# EAGLE design vc4pn (EAGLE 6.6.0)
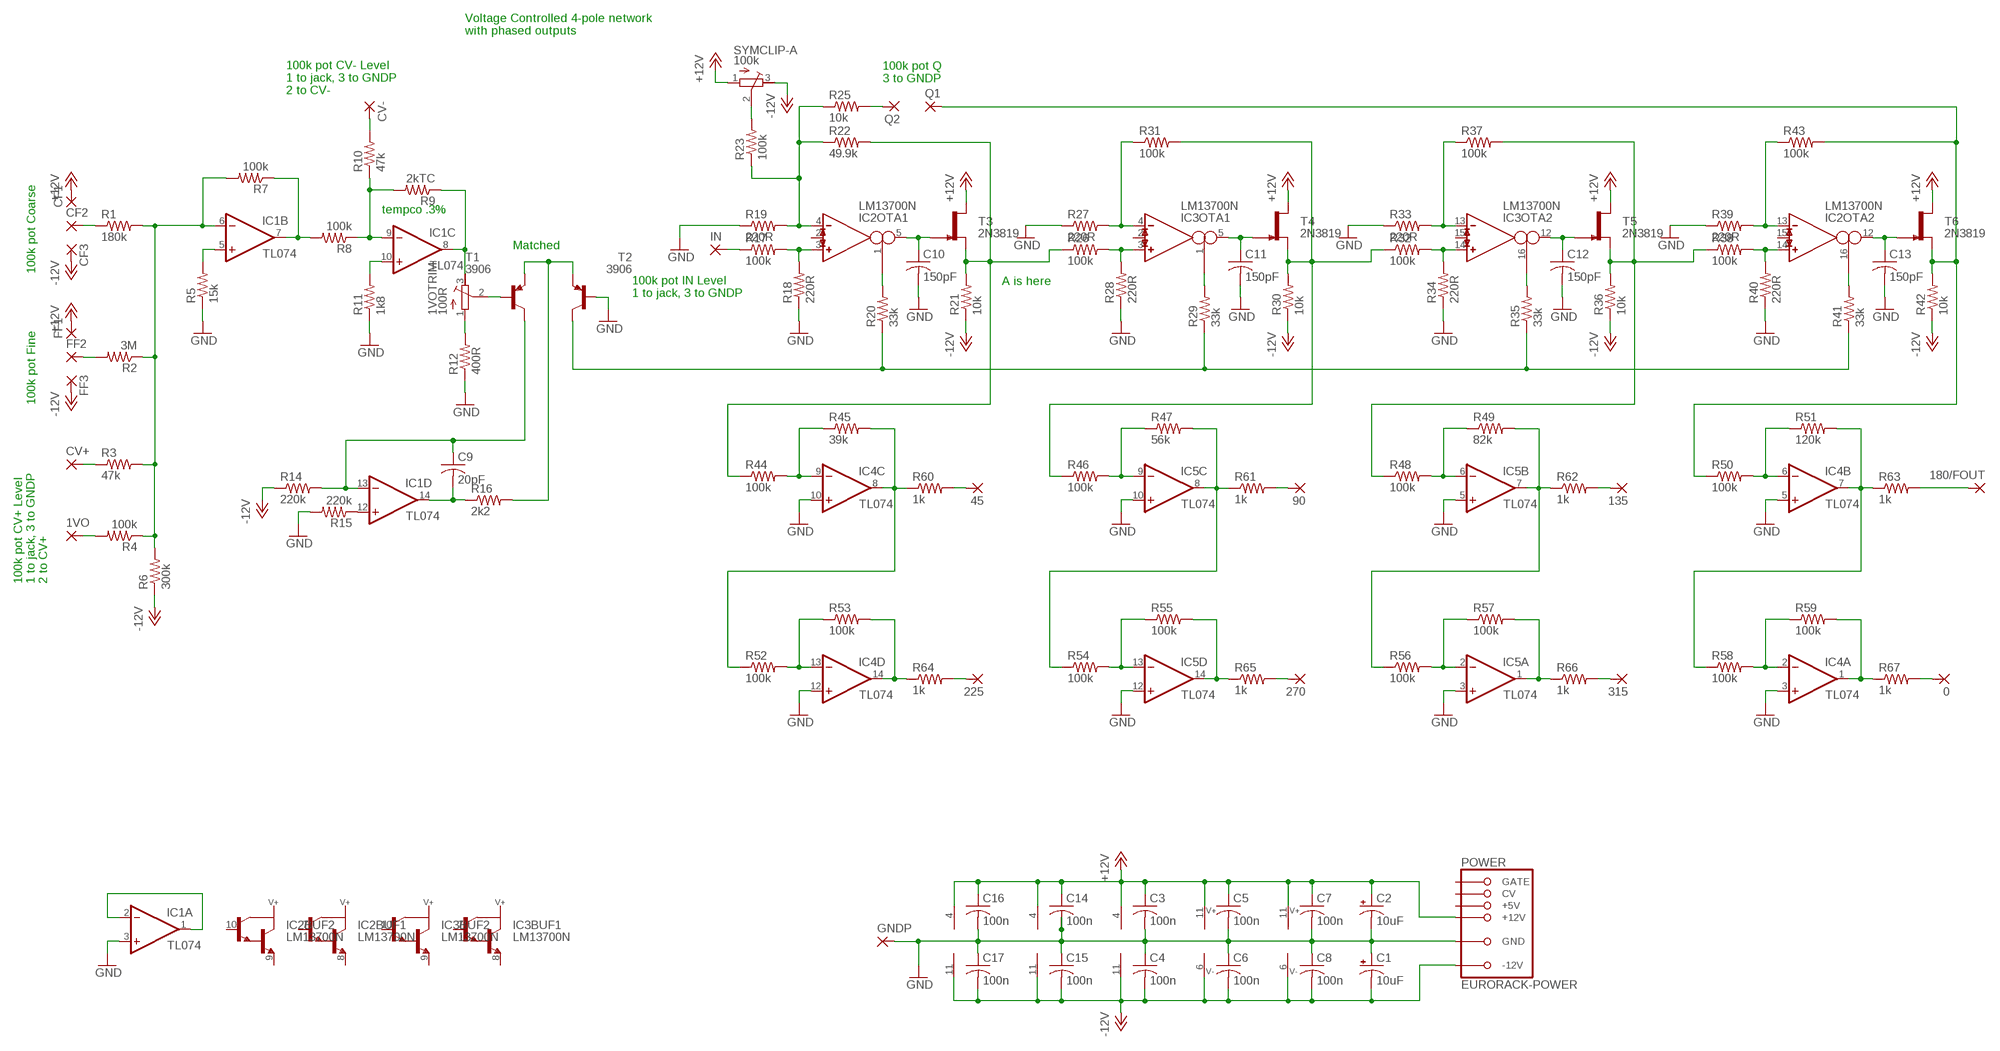
[diagram p0: schematic, sheet 1]

## Parts
0  2,54/1,0  [2,54/1,0]
1VO  2,54/1,0  [2,54/1,0]
1VOTRIM  100R  R-TRIMM64W  [RTRIM64W]
45  2,54/1,0  [2,54/1,0]
90  2,54/1,0  [2,54/1,0]
135  2,54/1,0  [2,54/1,0]
180/FOUT  2,54/1,0  [2,54/1,0]
225  2,54/1,0  [2,54/1,0]
270  2,54/1,0  [2,54/1,0]
315  2,54/1,0  [2,54/1,0]
C1  10uF  CPOL-USE2.5-5  [E2,5-5]
C2  10uF  CPOL-USE2.5-5  [E2,5-5]
C3  100n  C-US050-025X075  [C050-025X075]
C4  100n  C-US050-025X075  [C050-025X075]
C5  100n  C-US050-025X075  [C050-025X075]
C6  100n  C-US050-025X075  [C050-025X075]
C7  100n  C-US050-025X075  [C050-025X075]
C8  100n  C-US050-025X075  [C050-025X075]
C9  20pF  C-US050-025X075  [C050-025X075]
C10  150pF  C-US050-025X075  [C050-025X075]
C11  150pF  C-US050-025X075  [C050-025X075]
C12  150pF  C-US050-025X075  [C050-025X075]
C13  150pF  C-US050-025X075  [C050-025X075]
C14  100n  C-US050-025X075  [C050-025X075]
C15  100n  C-US050-025X075  [C050-025X075]
C16  100n  C-US050-025X075  [C050-025X075]
C17  100n  C-US050-025X075  [C050-025X075]
CF1  2,54/1,0  [2,54/1,0]
CF2  2,54/1,0  [2,54/1,0]
CF3  2,54/1,0  [2,54/1,0]
CV+  2,54/1,0  [2,54/1,0]
CV-  2,54/1,0  [2,54/1,0]
FF1  2,54/1,0  [2,54/1,0]
FF2  2,54/1,0  [2,54/1,0]
FF3  2,54/1,0  [2,54/1,0]
GNDP  2,54/1,0  [2,54/1,0]
IC1  TL074  TL074-TOPP  [DIL14]
IC2  LM13700N  [DIL16]
IC3  LM13700N  [DIL16]
IC4  TL074  TL074-TOPP  [DIL14]
IC5  TL074  TL074-TOPP  [DIL14]
IN  2,54/1,0  [2,54/1,0]
POWER  EURORACK-POWER  [PINSHRD_PTH_2X8]
Q1  2,54/1,0  [2,54/1,0]
Q2  2,54/1,0  [2,54/1,0]
R1  180k  R-US_0207/2V  [0207/2V]
R2  3M  R-US_0207/2V  [0207/2V]
R3  47k  R-US_0207/2V  [0207/2V]
R4  100k  R-US_0207/2V  [0207/2V]
R5  15k  R-US_0207/2V  [0207/2V]
R6  300k  R-US_0207/2V  [0207/2V]
R7  100k  R-US_0207/2V  [0207/2V]
R8  100k  R-US_0207/2V  [0207/2V]
R9  2kTC  R-US_0207/10  [0207/10]
R10  47k  R-US_0207/2V  [0207/2V]
R11  1k8  R-US_0207/2V  [0207/2V]
R12  400R  R-US_0207/2V  [0207/2V]
R14  220k  R-US_0207/2V  [0207/2V]
R15  220k  R-US_0207/2V  [0207/2V]
R16  2k2  R-US_0207/2V  [0207/2V]
R17  100k  R-US_0207/2V  [0207/2V]
R18  220R  R-US_0207/2V  [0207/2V]
R19  220R  R-US_0207/2V  [0207/2V]
R20  33k  R-US_0207/2V  [0207/2V]
R21  10k  R-US_0207/2V  [0207/2V]
R22  49.9k  R-US_0207/2V  [0207/2V]
R23  100k  R-US_0207/2V  [0207/2V]
R25  10k  R-US_0207/2V  [0207/2V]
R26  100k  R-US_0207/2V  [0207/2V]
R27  220R  R-US_0207/2V  [0207/2V]
R28  220R  R-US_0207/2V  [0207/2V]
R29  33k  R-US_0207/2V  [0207/2V]
R30  10k  R-US_0207/2V  [0207/2V]
R31  100k  R-US_0207/2V  [0207/2V]
R32  100k  R-US_0207/2V  [0207/2V]
R33  220R  R-US_0207/2V  [0207/2V]
R34  220R  R-US_0207/2V  [0207/2V]
R35  33k  R-US_0207/2V  [0207/2V]
R36  10k  R-US_0207/2V  [0207/2V]
R37  100k  R-US_0207/2V  [0207/2V]
R38  100k  R-US_0207/2V  [0207/2V]
R39  220R  R-US_0207/2V  [0207/2V]
R40  220R  R-US_0207/2V  [0207/2V]
R41  33k  R-US_0207/2V  [0207/2V]
R42  10k  R-US_0207/2V  [0207/2V]
R43  100k  R-US_0207/2V  [0207/2V]
R44  100k  R-US_0207/2V  [0207/2V]
R45  39k  R-US_0207/2V  [0207/2V]
R46  100k  R-US_0207/2V  [0207/2V]
R47  56k  R-US_0207/2V  [0207/2V]
R48  100k  R-US_0207/2V  [0207/2V]
R49  82k  R-US_0207/2V  [0207/2V]
R50  100k  R-US_0207/2V  [0207/2V]
R51  120k  R-US_0207/2V  [0207/2V]
R52  100k  R-US_0207/2V  [0207/2V]
R53  100k  R-US_0207/2V  [0207/2V]
R54  100k  R-US_0207/2V  [0207/2V]
R55  100k  R-US_0207/2V  [0207/2V]
R56  100k  R-US_0207/2V  [0207/2V]
R57  100k  R-US_0207/2V  [0207/2V]
R58  100k  R-US_0207/2V  [0207/2V]
R59  100k  R-US_0207/2V  [0207/2V]
R60  1k  R-US_0207/2V  [0207/2V]
R61  1k  R-US_0207/2V  [0207/2V]
R62  1k  R-US_0207/2V  [0207/2V]
R63  1k  R-US_0207/2V  [0207/2V]
R64  1k  R-US_0207/2V  [0207/2V]
R65  1k  R-US_0207/2V  [0207/2V]
R66  1k  R-US_0207/2V  [0207/2V]
R67  1k  R-US_0207/2V  [0207/2V]
SYMCLIP-A  100k  R-TRIMM64W  [RTRIM64W]
T1  3906  -PNP-TO92-EBC  [TO92-EBC]
T2  3906  -PNP-TO92-EBC  [TO92-EBC]
T3  2N3819  2N3819TO-92S  [TO92-]
T4  2N3819  2N3819TO-92S  [TO92-]
T5  2N3819  2N3819TO-92S  [TO92-]
T6  2N3819  2N3819TO-92S  [TO92-]

## Nets
+12V: C2.+ C3.1 C5.1 C7.1 C14.1 C16.1 CF1.1(P) FF1.1(P) IC1.4(P:V+) IC2.11 IC3.11 IC4.4(P:V+) IC5.4(P:V+) POWER.+12V@1(+12V) POWER.+12V@2(+12V) SYMCLIP-A.1(A) T3.3(D) T4.3(D) T5.3(D) T6.3(D)
-12V: C1.- C4.2 C6.2 C8.2 C15.2 C17.2 CF3.1(P) FF3.1(P) IC1.11(P:V-) IC2.6 IC3.6 IC4.11(P:V-) IC5.11(P:V-) POWER.-12V@1(-12V) POWER.-12V@2(-12V) R6.1 R14.1 R21.1 R30.1 R36.1 R42.1 SYMCLIP-A.3(E)
GND: C1.+ C2.- C3.2 C4.1 C5.2 C6.1 C7.2 C8.1 C10.2 C11.2 C12.2 C13.2 C14.2 C15.1 C16.2 C17.1 GNDP.1(P) IC1.3(A:+IN) IC4.3(A:+IN) IC4.5(B:+IN) IC4.10(C:+IN) IC4.12(D:+IN) IC5.3(A:+IN) IC5.5(B:+IN) IC5.10(C:+IN) IC5.12(D:+IN) POWER.GND@1(GND) POWER.GND@2(GND) POWER.GND@3(GND) POWER.GND@4(GND) POWER.GND@5(GND) POWER.GND@6(GND) R5.1 R11.1 R12.1 R15.2 R18.1 R19.1 R27.1 R28.1 R33.1 R34.1 R39.1 R40.1 T2.B
N$1: CF2.1(P) R1.1
N$2: FF2.1(P) R2.2
N$3: CV+.1(P) R3.1
N$4: IC1.1(A:OUT) IC1.2(A:-IN)
N$5: 1VO.1(P) R4.2
N$6: IC1.5(B:+IN) R5.2
N$7: CV-.1(P) R10.2
N$8: IC1.6(B:-IN) R1.2 R2.1 R3.2 R4.1 R6.2 R7.2
N$9: IC1.7(B:OUT) R7.1 R8.2
N$10: IC1.9(C:-IN) R8.1 R9.2 R10.1
N$11: 1VOTRIM.3(E) IC1.8(C:OUT) R9.1
N$12: 1VOTRIM.1(A) R12.2
N$13: IC1.10(C:+IN) R11.2
N$14: R16.2 T1.E T2.E
N$15: 1VOTRIM.2(S) T1.B
N$16: C9.1 IC1.13(D:-IN) R14.2 T1.C
N$17: IC1.12(D:+IN) R15.1
N$18: C9.2 IC1.14(D:OUT) R16.1
N$19: IN.1(P) R17.1
N$20: IC2.3(OTA1:IN_P) R17.2 R18.2
N$21: IC2.4(OTA1:IN_N) R19.2 R22.1 R23.1 R25.1
N$22: IC2.1(OTA1:I_BIAS) R20.2
N$23: R20.1 R29.1 R35.1 R41.1 T2.C
N$24: C10.1 IC2.5(OTA1:OUT) T3.2(G)
N$25: R21.2 R22.2 R26.1 R44.1 T3.1(S)
N$26: IC3.3(OTA1:IN_P) R26.2 R28.2
N$27: R23.2 SYMCLIP-A.2(S)
N$28: IC3.4(OTA1:IN_N) R27.2 R31.1
N$29: IC3.1(OTA1:I_BIAS) R29.2
N$30: Q2.1(P) R25.2
N$31: C11.1 IC3.5(OTA1:OUT) T4.2(G)
N$32: R30.2 R31.2 R32.1 R46.1 T4.1(S)
N$33: IC4.9(C:-IN) R44.2 R45.1
N$34: IC5.9(C:-IN) R46.2 R47.1
N$35: IC3.14(OTA2:IN_P) R32.2 R34.2
N$36: IC3.13(OTA2:IN_N) R33.2 R37.1
N$37: IC3.16(OTA2:I_BIAS) R35.2
N$38: C12.1 IC3.12(OTA2:OUT) T5.2(G)
N$39: R36.2 R37.2 R38.1 R48.1 T5.1(S)
N$40: IC5.6(B:-IN) R48.2 R49.1
N$41: IC4.6(B:-IN) R50.2 R51.1
N$42: IC2.14(OTA2:IN_P) R38.2 R40.2
N$43: IC2.13(OTA2:IN_N) R39.2 R43.1
N$44: IC2.16(OTA2:I_BIAS) R41.2
N$45: C13.1 IC2.12(OTA2:OUT) T6.2(G)
N$46: Q1.1(P) R42.2 R43.2 R50.1 T6.1(S)
N$47: IC4.13(D:-IN) R52.2 R53.1
N$48: IC5.13(D:-IN) R54.2 R55.1
N$49: IC5.2(A:-IN) R56.2 R57.1
N$50: IC4.2(A:-IN) R58.2 R59.1
N$51: IC4.8(C:OUT) R45.2 R52.1 R60.1
N$52: IC5.8(C:OUT) R47.2 R54.1 R61.1
N$53: IC5.7(B:OUT) R49.2 R56.1 R62.1
N$54: IC4.7(B:OUT) R51.2 R58.1 R63.1
N$55: IC4.14(D:OUT) R53.2 R64.1
N$56: IC5.14(D:OUT) R55.2 R65.1
N$57: IC5.1(A:OUT) R57.2 R66.1
N$58: IC4.1(A:OUT) R59.2 R67.1
N$59: 45.1(P) R60.2
N$60: 90.1(P) R61.2
N$61: 135.1(P) R62.2
N$62: 180/FOUT.1(P) R63.2
N$63: 225.1(P) R64.2
N$64: 270.1(P) R65.2
N$65: 315.1(P) R66.2
N$66: 0.1(P) R67.2
Unconnected: IC2.2(OTA1:I_DIODE) IC2.7(BUF1:B) IC2.8(BUF1:E) IC2.9(BUF2:E) IC2.10(BUF2:B) IC2.15(OTA2:I_DIODE) IC3.2(OTA1:I_DIODE) IC3.7(BUF1:B) IC3.8(BUF1:E) IC3.9(BUF2:E) IC3.10(BUF2:B) IC3.15(OTA2:I_DIODE) POWER.+5V@1(+5V) POWER.+5V@2(+5V) POWER.CV@1(CV) POWER.CV@2(CV) POWER.GATE@1(GATE) POWER.GATE@2(GATE)

## Notes on the sheet
- Voltage Controlled 4-pole network
  with phased outputs
- 100k pot Q
  3 to GNDP
- 100k pot CV- Level
  1 to jack, 3 to GNDP
  2 to CV-
- tempco .3%
- Matched
- 100k pot Coarse
- A is here
- 100k pot IN Level
  1 to jack, 3 to GNDP
- 100k pot Fine
- 100k pot CV+ Level
  1 to jack, 3 to GNDP
  2 to CV+

## Library data of the parts
0 1VO 45 90 135 180/FOUT 225 270 315 CF1-CF3 CV+ CV- FF1-FF3 GNDP IN Q1 Q2 = wirepad:2,54/1,0: THROUGH-HOLE PAD
1VOTRIM SYMCLIP-A = rcl:R-TRIMM: Trimm resistor
C1 C2 = rcl:CPOL-US: POLARIZED CAPACITOR, American symbol
C3-C17 = rcl:C-US: CAPACITOR, American symbol
IC1 IC4 IC5 = mmoretti:TL074-TOP: OP AMP
IC2 IC3 = mmoretti:LM13700: Dual OTA with buffers
POWER = mmoretti:EURORACK-POWER
R1-R12 R14-R23 R25-R67 = rcl:R-US_: RESISTOR, American symbol
T1 T2 = transistor-neu-to92:*-PNP-: PNP Transistror
T3-T6 = gm-trans:2N3819: N-CHANNEL FET

## Board
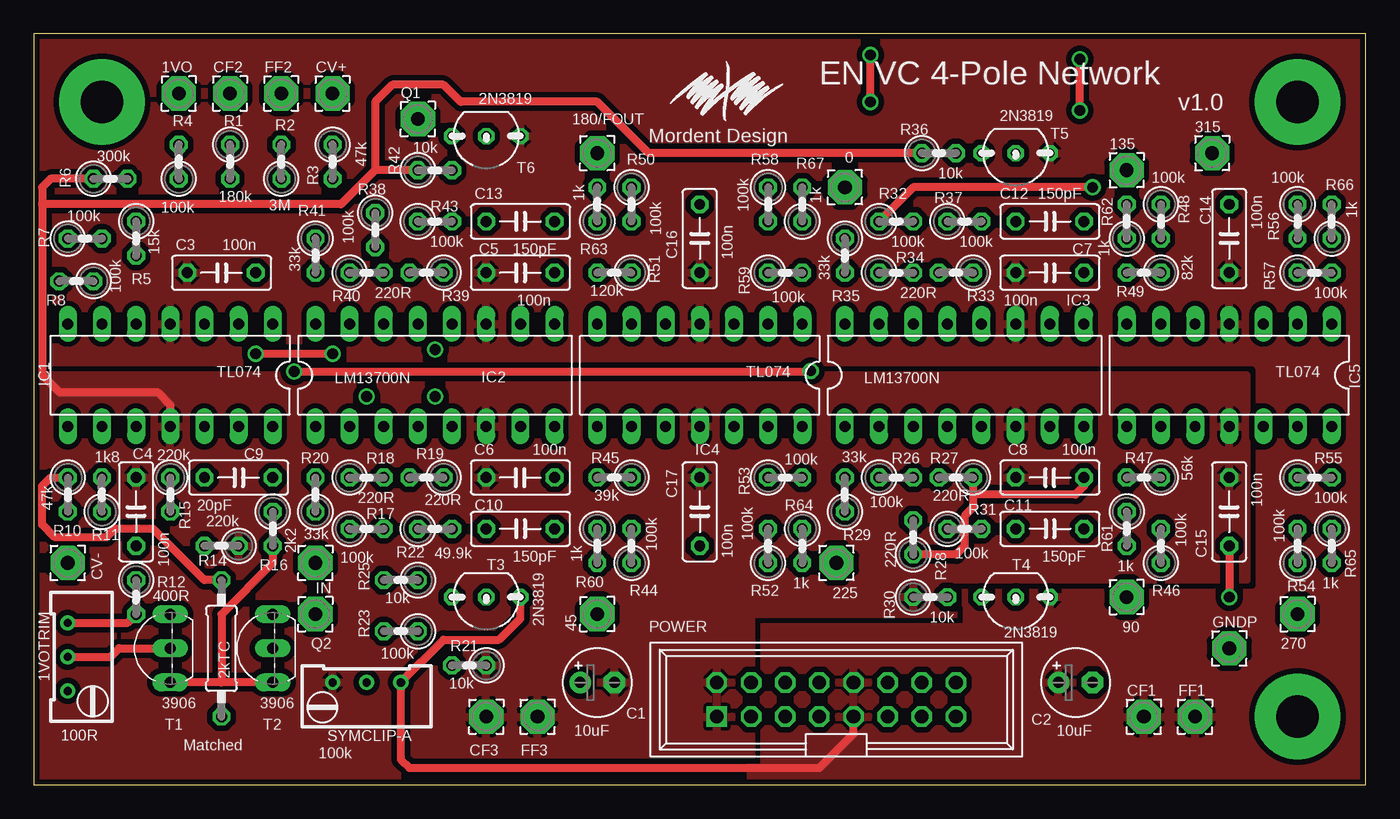
[diagram p1: board, top side]
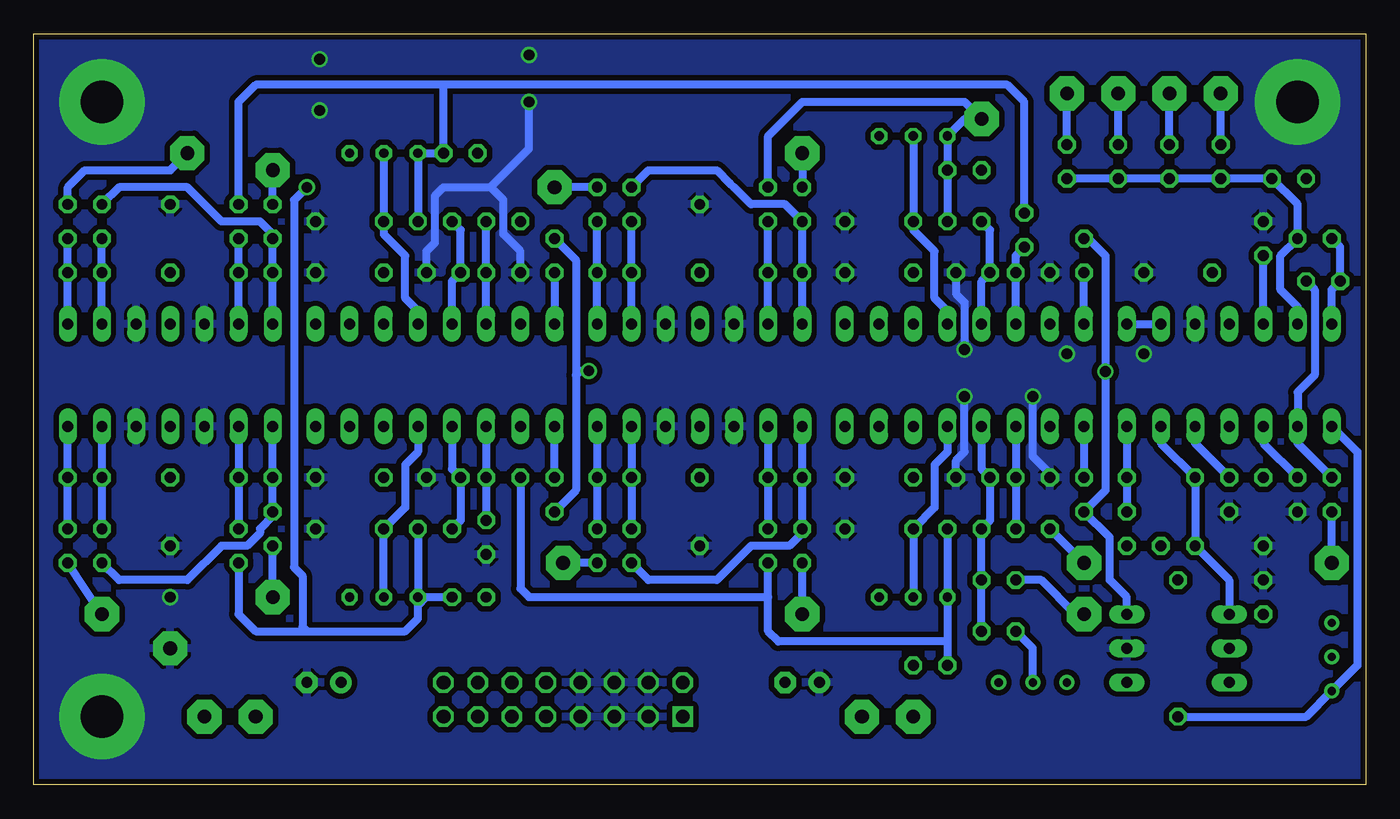
[diagram p2: board, bottom side, seen from below]

Size 99.06 x 55.88 mm. Coordinates in mm from the lower left corner, seen from the top.
Outline: 0,0 99.04,0 99.06,55.88 0,55.88 0,0
Copper layers (1*16): Top 0.035mm / dielectric 1.5mm / Bottom 0.035mm
Design rules "SeeedStudio_2layer_DRU_no_angle_20140221": minimum track width 6mil, minimum drill 12mil, track to track 6mil, track to pad 6mil, pad to pad 6mil, via to via 6mil, smd to smd 0mil, copper to edge 10mil, drill to drill 10mil, minimum pad ring 10mil, minimum via ring 6mil, stop-mask expansion 2mil, vias tented up to drill 100mil, thermal gap 10mil

### Footprints (pad centres in the part's own frame; a part is rotated, then mirrored left to right if it is on the bottom)
2,54/1,0 = drill 1.016 pad 2.54 octagon: 1 0,0
RTRIM64W = drill 0.61: 1 1.27,-2.54; 2 1.27,0; 3 1.27,2.54
E2,5-5 = drill 0.813 pad 1.6: + -1.27,0 | drill 0.813 pad 1.6 octagon: - 1.27,0
C050-025X075 = drill 0.813 octagon: 1 -2.54,0; 2 2.54,0
DIL14 = drill 0.813 long: 1 -7.62,-3.81; 2 -5.08,-3.81; 3 -2.54,-3.81; 4 0,-3.81; 5 2.54,-3.81; 6 5.08,-3.81; 7 7.62,-3.81; 8 7.62,3.81; 9 5.08,3.81; 10 2.54,3.81; 11 0,3.81; 12 -2.54,3.81; 13 -5.08,3.81; 14 -7.62,3.81
DIL16 = drill 0.813 long: 1 -8.89,-3.81; 2 -6.35,-3.81; 3 -3.81,-3.81; 4 -1.27,-3.81; 5 1.27,-3.81; 6 3.81,-3.81; 7 6.35,-3.81; 8 8.89,-3.81; 9 8.89,3.81; 10 6.35,3.81; 11 3.81,3.81; 12 1.27,3.81; 13 -1.27,3.81; 14 -3.81,3.81; 15 -6.35,3.81; 16 -8.89,3.81
PINSHRD_PTH_2X8 = drill 1.016 octagon: +5V@1 3.81,1.27; +5V@2 3.81,-1.27; +12V@1 1.27,1.27; +12V@2 1.27,-1.27; -12V@1 -8.89,1.27; CV@1 6.35,1.27; CV@2 6.35,-1.27; GATE@1 8.89,1.27; GATE@2 8.89,-1.27; GND@1 -6.35,1.27; GND@2 -6.35,-1.27; GND@3 -3.81,1.27; GND@4 -3.81,-1.27; GND@5 -1.27,1.27; GND@6 -1.27,-1.27 | drill 1.016 square: -12V@2 -8.89,-1.27
0207/2V = drill 0.813 octagon: 1 -1.27,0; 2 1.27,0
0207/10 = drill 0.813 octagon: 1 -5.08,0; 2 5.08,0
TO92-EBC = drill 0.813 long: B 0,-1.27; C 2.54,-1.27; E -2.54,-1.27
TO92- = drill 0.7 octagon: 1 2.54,0; 2 0,0; 3 -2.54,0

### Placement (x,y rotation side)
0  60.33,44.45 90 top
1VO  10.79,51.44 0 top
1VOTRIM  3.81,9.53 180 top
45  41.91,12.7 90 top
90  81.28,13.97 90 top
135  81.28,45.72 270 top
180/FOUT  41.91,46.99 90 top
225  59.69,16.51 90 top
270  93.98,12.7 270 top
315  87.63,46.99 270 top
C1  41.91,7.62 0 top
C2  77.47,7.62 0 top
C3  13.97,38.1 0 top
C4  7.62,20.32 90 top
C5  36.2,38.1 0 top
C6  36.2,22.86 180 top
C7  75.56,38.1 0 top
C8  75.56,22.86 180 top
C9  15.24,22.86 0 top
C10  36.2,19.05 0 top
C11  75.56,19.05 0 top
C12  75.56,41.91 0 top
C13  36.2,41.91 0 top
C14  88.9,40.64 90 top
C15  88.9,20.32 90 top
C16  49.53,40.64 90 top
C17  49.53,20.32 90 top
CF1  82.55,5.08 0 top
CF2  14.61,51.44 0 top
CF3  33.66,5.08 0 top
CV+  22.23,51.44 0 top
CV-  2.54,16.51 0 top
FF1  86.36,5.08 0 top
FF2  18.41,51.44 0 top
FF3  37.47,5.08 0 top
GNDP  88.9,10.16 0 top
IC1  10.16,30.48 180 top
IC2  29.84,30.48 0 top
IC3  69.22,30.48 0 top
IC4  49.53,30.48 180 top
IC5  88.9,30.48 180 top
IN  20.95,16.51 0 top
POWER  59.69,6.35 0 top
Q1  28.57,49.53 0 top
Q2  20.95,12.7 0 top
R1  14.61,46.35 270 top
R2  18.41,46.35 90 top
R3  22.23,46.35 270 top
R4  10.79,46.35 90 top
R5  7.62,40.64 270 top
R6  5.71,45.09 0 top
R7  3.81,40.64 0 top
R8  3.17,37.47 180 top
R9  13.97,10.16 90 top
R10  2.54,21.59 270 top
R11  5.08,21.59 90 top
R12  7.62,13.97 270 top
R14  13.97,17.78 180 top
R15  10.16,21.59 270 top
R16  17.78,19.05 270 top
R17  24.77,19.05 0 top
R18  24.77,22.86 0 top
R19  29.21,22.86 180 top
R20  20.95,21.59 90 top
R21  32.38,8.89 180 top
R22  29.84,19.05 0 top
R23  27.3,11.43 180 top
R25  27.3,15.24 180 top
R26  64.14,22.86 0 top
R27  68.58,22.86 180 top
R28  65.41,18.41 90 top
R29  60.33,21.59 90 top
R30  66.67,13.97 0 top
R31  69.22,19.05 0 top
R32  64.14,41.91 0 top
R33  68.58,38.1 180 top
R34  64.14,38.1 0 top
R35  60.33,39.37 270 top
R36  67.31,46.99 0 top
R37  69.22,41.91 0 top
R38  25.4,41.27 270 top
R39  29.21,38.1 180 top
R40  24.77,38.1 0 top
R41  20.95,39.37 270 top
R42  29.84,45.72 0 top
R43  29.84,41.91 0 top
R44  44.45,17.78 90 top
R45  43.18,22.86 180 top
R46  83.82,17.78 90 top
R47  82.55,22.86 180 top
R48  83.82,41.91 270 top
R49  82.55,38.1 180 top
R50  44.45,43.18 270 top
R51  43.18,38.1 180 top
R52  54.61,17.78 90 top
R53  55.88,22.86 0 top
R54  93.98,17.78 90 top
R55  95.25,22.86 0 top
R56  93.98,41.91 270 top
R57  95.25,38.1 0 top
R58  54.61,43.18 270 top
R59  55.88,38.1 0 top
R60  41.91,17.78 270 top
R61  81.28,19.05 270 top
R62  81.28,41.91 90 top
R63  41.91,43.18 90 top
R64  57.15,17.78 270 top
R65  96.52,17.78 270 top
R66  96.52,41.91 90 top
R67  57.15,43.18 90 top
SYMCLIP-A  24.77,6.35 90 top
T1  8.89,10.16 90 top
T2  16.51,10.16 90 top
T3  33.66,13.97 180 top
T4  73.03,13.97 180 top
T5  73.03,46.99 180 top
T6  33.66,48.26 180 top

### Tracks (layer width: path | path; a pad name or v marks a point on that pad's centre or on a via)
+12V
  Top 0.61: POWER.+12V@2 60.96,3.81 58.42,1.27 27.94,1.27 27.3,1.91 SYMCLIP-A.1 30.48,10.79 34.61,10.79 36.2,12.38 T3.3
  pour Top (isolate 0.406, rank 2): 53.34,0 53.34,12.7 68.58,12.7 68.58,15.24 90.17,15.24 90.17,30.48 0,30.48 0,55.88 99.06,55.88 99.06,0
-12V
  Top 0.61: 0.64,43.18 0.64,44.45 1.27,45.09 R6.1 | 0.64,43.18 0.64,30.48 1.91,29.21 9.21,29.21 10.16,28.26 IC1.11 | R42.1 25.4,45.72 | 25.4,45.72 22.86,43.18 0.64,43.18 | R36.1 45.72,46.99 41.91,50.8 31.75,50.8 30.48,52.07 26.67,52.07 25.4,50.8 25.4,45.72
  pour Top (isolate 0.406): 53.34,0 0,0 0,30.48 90.17,30.48 90.17,15.24 68.58,15.24 68.58,12.7 53.34,12.7
GND  (via drill 0.8, 3.17 pad 6.35)
  Top 0.61: C15.1 v88.9,13.97 | R27.1 69.85,21.59 | 69.85,21.59 69.85,20.64 69.22,20 69.22,17.78 68.58,17.14 R28.1 | C8.1 78.11,22.23 77.47,21.59 69.85,21.59 | v77.79,50.16 v77.79,53.98 | v22.23,32.07 v16.51,32.07 | v62.23,50.8 v62.23,54.29
  Bottom 0.61: R39.1 30.48,36.51 29.84,35.88 v29.84,32.38 | R18.1 23.5,23.18 24.77,24.45 v24.77,28.89 | R19.1 30.48,24.13 29.84,24.77 v29.84,28.89 | R33.1 69.85,39.69 69.22,40.32 69.22,43.81 68.58,44.45 65.09,44.45 | 65.09,44.45 62.23,47.31 v62.23,50.8 | R34.1 62.87,39.69 64.14,40.96 64.14,43.5 65.09,44.45
  other vias: 5.08,50.8 93.98,50.8 93.98,5.08
  pour Bottom (isolate 0.406): 0,55.88 99.06,55.88 99.06,0 0,0
N$1
  Bottom 0.61: R1.1 CF2.1
N$2
  Bottom 0.61: R2.2 FF2.1
N$3
  Bottom 0.61: R3.1 CV+.1
N$4
  Bottom 0.61: IC1.1 IC1.2
N$5
  Bottom 0.61: R4.2 1VO.1
N$6
  Bottom 0.61: IC1.5 R5.2
N$7
  Bottom 0.61: CV-.1 R10.2
N$8
  Bottom 0.61: IC1.6 5.08,35.56 6.35,36.83 6.35,39.37 R7.2 5.08,43.18 R6.2 R4.1 R1.2 R2.1 R3.2
N$9
  Bottom 0.61: IC1.7 2.54,36.83 R8.2 1.91,40.01 R7.1
N$10
  Top 0.61: R9.2 12.7,15.24 8.89,19.05 6.03,19.05 5.4,18.41 1.59,18.41 0.64,19.37 0.64,22.23 1.27,22.86 R10.1
  Bottom 0.61: R8.1 3.81,36.83 3.81,30.48 5.08,29.21 IC1.9 5.08,25.4 R10.1
N$11
  Bottom 0.61: IC1.8 0.64,24.77 0.64,8.89 1VOTRIM.3 4.45,5.08 R9.1
N$12
  Top 0.61: 1VOTRIM.1 6.99,12.06 R12.2
N$13
  Bottom 0.61: IC1.10 7.62,25.4 R11.2
N$14
  Top 0.61: T2.E 13.97,7.62 | 13.97,7.62 T1.E | R16.2 17.78,16.51 13.97,12.7 13.97,7.62
N$15
  Top 0.61: 1VOTRIM.2 5.71,9.53 6.35,10.16 T1.B
N$16
  Bottom 0.61: IC1.13 15.24,25.4 C9.1 R14.2 10.16,15.24 T1.C
N$17
  Bottom 0.61: IC1.12 12.7,25.4 R15.1
N$18
  Bottom 0.61: IC1.14 C9.2 R16.1
N$19
  Bottom 0.61: IN.1 R17.1
N$20
  Bottom 0.61: IC2.3 R18.2 R17.2
N$21
  Bottom 0.61: R23.1 R25.1 R22.1 27.94,19.68 R19.2 28.57,23.5 IC2.4
N$22
  Bottom 0.61: IC2.1 R20.2
N$23  (via drill 0.8)
  Top 0.61: v19.37,30.75 57.73,30.75 v57.78,30.8
  Bottom 0.61: T2.C 17.78,13.97 19.05,15.24 19.05,18.41 R20.1 19.37,21.91 v19.37,30.75 19.37,39.37 20.64,40.64 R41.1 | R35.1 58.74,39.05 58.74,30.48 | 58.74,30.48 58.74,21.91 R29.1 | v57.78,30.8 58.42,30.8 58.74,30.48
N$24
  Bottom 0.61: IC2.5 31.11,24.77 32.07,23.81 32.07,20.64 C10.1 T3.2
N$25
  Bottom 0.61: R22.2 T3.1 31.11,10.67 | 31.11,10.67 R21.2 | R26.1 62.87,14.61 62.23,13.97 44.45,13.97 | 44.45,13.97 R44.1 | 31.11,10.67 43.69,10.67 44.45,11.43 44.45,13.97
N$26
  Bottom 0.61: IC3.3 R26.2 R28.2
N$27
  Bottom 0.61: SYMCLIP-A.2 24.77,10.16 R23.2
N$28
  Bottom 0.61: IC3.4 67.94,23.5 R27.2 67.31,19.68 R31.1
N$29
  Bottom 0.61: R29.2 IC3.1
N$30
  Bottom 0.61: Q2.1 21.59,12.7 24.13,15.24 R25.2
N$31
  Bottom 0.61: IC3.5 70.48,24.77 71.44,23.81 71.44,20.64 C11.1 T4.2
N$32  (via drill 0.8)
  Top 0.61: v78.74,44.45 65.41,44.45 R32.1
  Bottom 0.61: R31.2 T4.1 69.85,13.97 | 69.85,13.97 R30.2 | R46.1 83.82,12.7 82.55,11.43 78.74,11.43 | 78.74,11.43 71.44,11.43 70.48,12.38 70.48,13.34 69.85,13.97 | v78.74,44.45 79.69,43.5 79.69,16.19 79.06,15.56 79.06,11.75 78.74,11.43
N$33
  Bottom 0.61: IC4.9 R45.1 R44.2
N$34
  Bottom 0.61: IC5.9 R47.1 R46.2
N$35
  Bottom 0.61: IC3.14 R34.2 R32.2
N$36
  Bottom 0.61: IC3.13 67.94,37.47 R33.2 67.31,41.27 R37.1
N$37
  Bottom 0.61: R35.2 IC3.16
N$38
  Bottom 0.61: T5.2 C12.1 73.03,40.96 71.44,39.37 71.44,36.2 70.48,35.24 IC3.12
N$39
  Bottom 0.61: R37.2 T5.1 R36.2 68.58,52.07 | R38.1 25.4,50.8 26.67,52.07 68.58,52.07 | 68.58,52.07 82.55,52.07 83.82,50.8 R48.1
N$40
  Bottom 0.61: IC5.6 R49.1 R48.2
N$41
  Bottom 0.61: IC4.6 R51.1 R50.2
N$42
  Bottom 0.61: IC2.14 R40.2 26.04,39.37 R38.2
N$43
  Bottom 0.61: IC2.13 28.57,37.47 R39.2 27.94,41.27 R43.1
N$44
  Bottom 0.61: IC2.16 R41.2
N$45
  Bottom 0.61: T6.2 C13.1 33.66,41.27 32.07,39.69 32.07,36.2 31.11,35.24 IC2.12
N$46
  Bottom 0.61: R43.2 R42.2 T6.1 29.84,49.53 Q1.1 29.84,50.8 41.91,50.8 44.45,48.26 R50.1
N$47
  Bottom 0.61: IC4.13 R53.1 R52.2
N$48
  Bottom 0.61: IC5.13 R55.1 R54.2
N$49
  Bottom 0.61: IC5.2 R57.1 R56.2
N$50
  Bottom 0.61: IC4.2 R59.1 R58.2
N$51
  Bottom 0.61: IC4.8 R45.2 R60.1 41.91,18.73 42.86,17.78 45.72,17.78 48.26,15.24 53.34,15.24 R52.1
N$52
  Bottom 0.61: IC5.8 R47.2 R61.1 81.28,20 82.23,19.05 82.23,18.73 83.19,17.78 85.09,17.78 87.63,15.24 92.71,15.24 R54.1
N$53
  Bottom 0.61: IC5.7 R49.2 R62.1 81.28,40.96 82.23,41.91 85.09,41.91 87.63,44.45 92.71,44.45 R56.1
N$54
  Bottom 0.61: IC4.7 R51.2 R63.1 43.18,43.18 45.72,43.18 46.99,44.45 47.31,44.77 48.26,45.72 53.34,45.72 R58.1
N$55
  Bottom 0.61: IC4.14 R53.2 R64.1
N$56
  Bottom 0.61: R65.1 R55.2 IC5.14
N$57
  Bottom 0.61: IC5.1 R57.2 R66.1
N$58
  Bottom 0.61: IC4.1 R59.2 R67.1
N$59
  Bottom 0.61: 45.1 R60.2
N$60
  Bottom 0.61: 90.1 R61.2
N$61
  Bottom 0.61: R62.2 135.1
N$62
  Bottom 0.61: 180/FOUT.1 R63.2
N$63
  Bottom 0.61: R64.2 225.1
N$64
  Bottom 0.61: 270.1 R65.2
N$65
  Bottom 0.61: R66.2 96.52,44.45 95.25,45.72 88.9,45.72 315.1
N$66
  Bottom 0.61: R67.2 0.1

### Text on the board
tPlace: EN VC 4-Pole Network | v1.0 | Mordent Design
tNames: Matched